# EAGLE design Adafruit SHT31 Breakout (EAGLE 6.6.0)
COMPANY: ADAFRUIT INDUSTRIES; DRAWN: KTOWN; REV: A
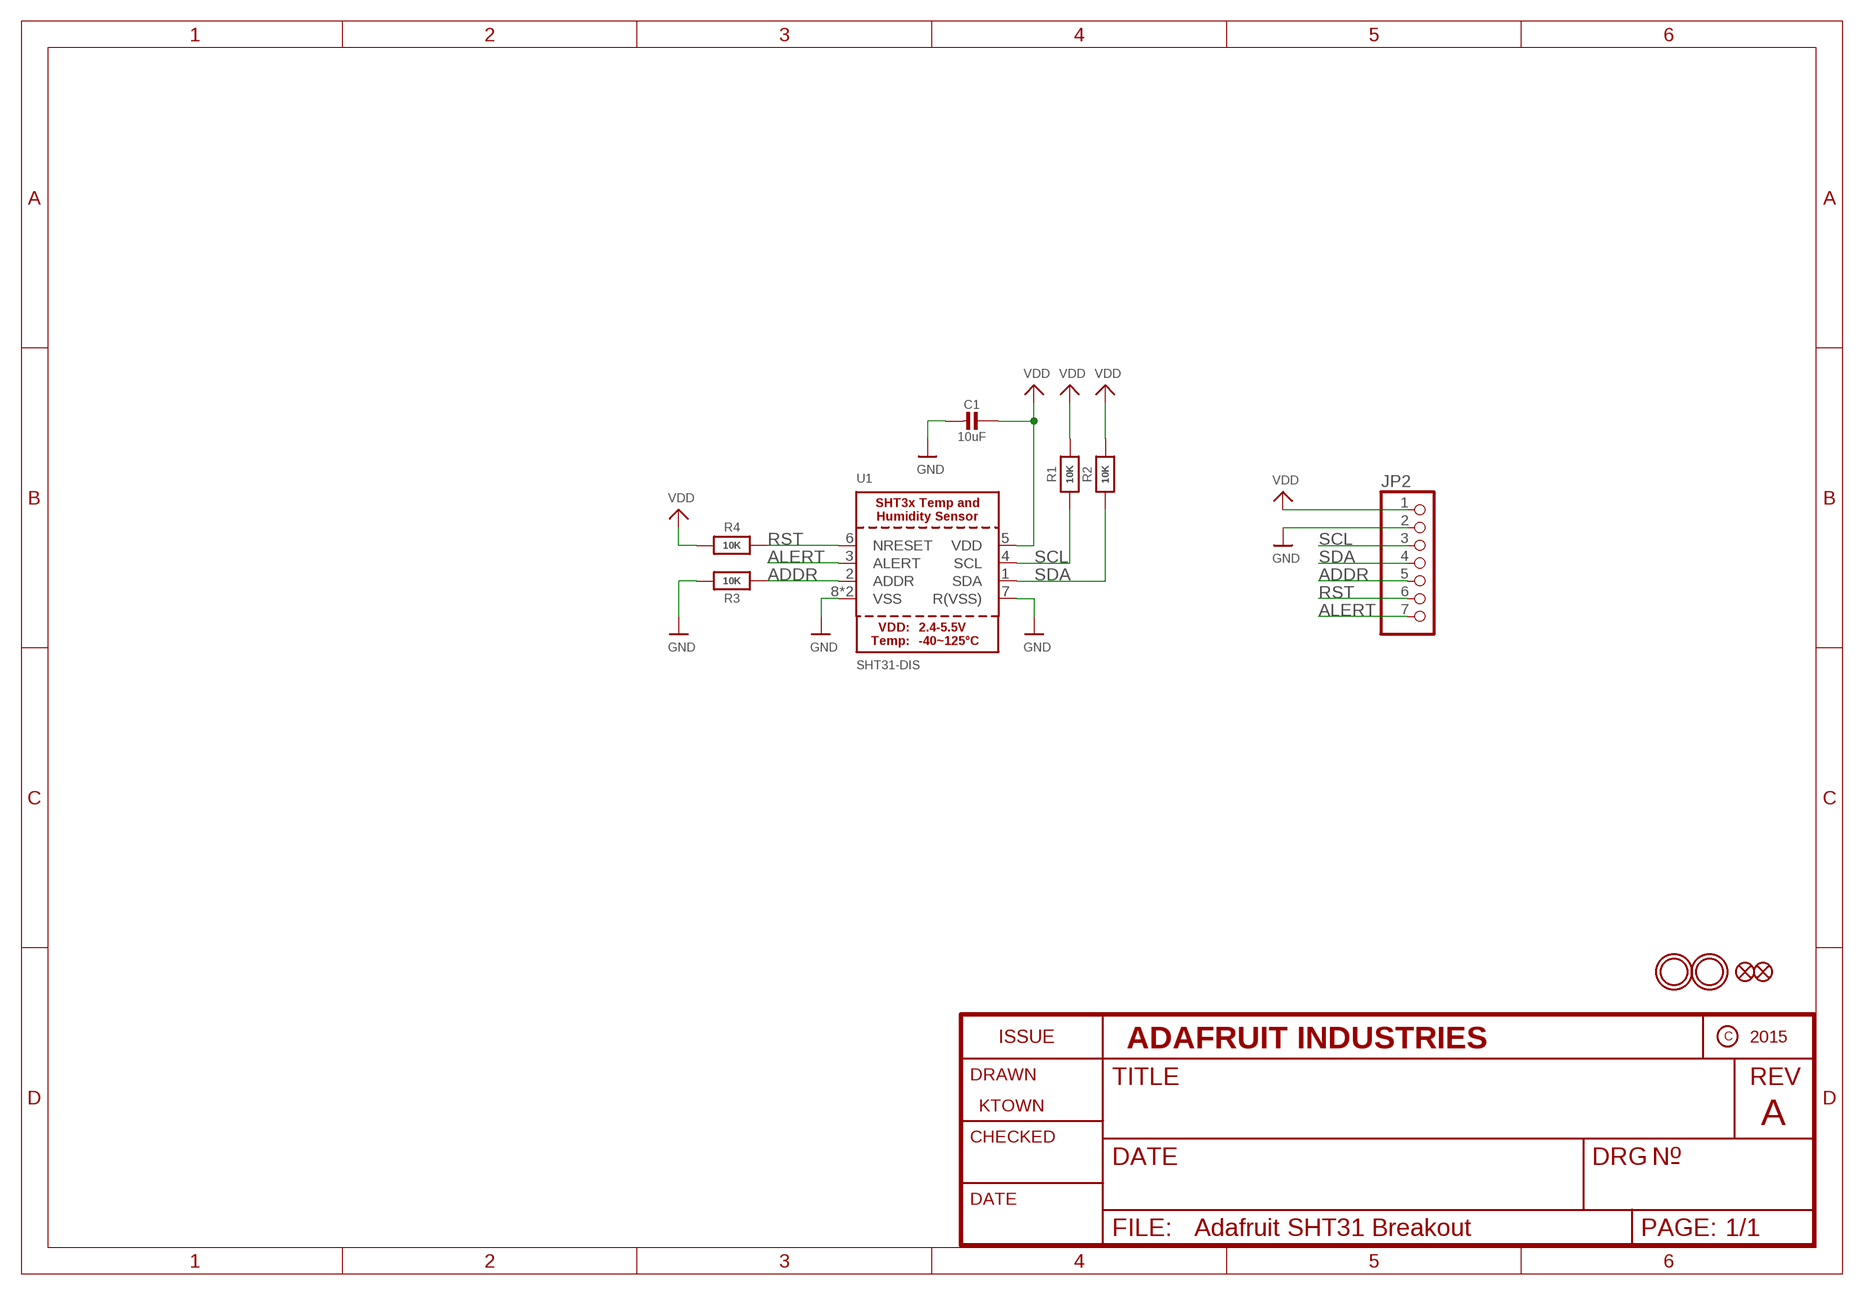
[diagram p0: schematic, sheet 1]

## Parts
C1  10uF  CAP_CERAMIC0805-NOOUTLINE  [0805-NO]
FID2  FIDUCIAL""  [FIDUCIAL_1MM]
FID3  FIDUCIAL""  [FIDUCIAL_1MM]
JP2  HEADER-1X770MIL  [1X07_ROUND_70]
R1  10K  RESISTOR0805_NOOUTLINE  [0805-NO]
R2  10K  RESISTOR0805_NOOUTLINE  [0805-NO]
R3  10K  RESISTOR_0805MP  [_0805MP]
R4  10K  RESISTOR0805_NOOUTLINE  [0805-NO]
U1  SHT31-DIS  SHT3X  [SHT3X]
U$1  MOUNTINGHOLE2.5  [MOUNTINGHOLE_2.5_PLATED]
U$2  MOUNTINGHOLE2.5  [MOUNTINGHOLE_2.5_PLATED]

## Nets
ADDR: JP2.5 R3.1 U1.2(ADDR)
ALERT: JP2.7 U1.3(ALERT)
GND: C1.2 JP2.2 R3.2 U1.7(R(VSS)) U1.8(VSS) U1.THERMAL(VSS)
RST: JP2.6 R4.2 U1.6(NRESET)
SCL: JP2.3 R1.1 U1.4(SCL)
SDA: JP2.4 R2.1 U1.1(SDA)
VDD: C1.1 JP2.1 R1.2 R2.2 R4.1 U1.5(VDD)

## Library data of the parts
C1 = microbuilder:CAP_CERAMIC: Ceramic Capacitors For new designs, use the packages preceded by an '_' character since they are more reliable: The following footprints should be used on most boards: _0402 - Standard footprint for regular board layouts _0603 - Standard footprint for regular board layouts _0805 - Standard footprint for regular board layouts _1206 - Standard footprint for regular board layouts For extremely tight-pitch boards where space is at a premium, the following 'micro-pitch' footprints can be used (smaller pads, no silkscreen outline, etc.): _0402MP - Micro-pitch footprint for very dense/compact boards _0603MP - Micro-pitch footprint for very dense/compact boards _0805MP - Micro-pitch footprint for very dense/compact boards _1206MP - Micro-pitch footprint for very dense/compact boards
FID2 FID3 = microbuilder:FIDUCIAL: Fiducial Alignment Points Various fiducial points for machine vision alignment.; BOM: EXCLUDE
JP2 = microbuilder:HEADER-1X7: PIN HEADER
R1-R4 = microbuilder:RESISTOR: Resistors For new designs, use the packages preceded by an '_' character since they are more reliable: The following footprints should be used on most boards: _0402 - Standard footprint for regular board layouts _0603 - Standard footprint for regular board layouts _0805 - Standard footprint for regular board layouts _1206 - Standard footprint for regular board layouts For extremely tight-pitch boards where space is at a premium, the following 'micro-pitch' footprints can be used (smaller pads, no silkscreen outline, etc.): _0402MP - Micro-pitch footprint for very dense/compact boards _0603MP - Micro-pitch footprint for very dense/compact boards _0805MP - Micro-pitch footprint for very dense/compact boards _1206MP - Micro-pitch footprint for very dense/compact boards
U1 = microbuilder:SHT3X: SHT3x - Digital Temperature and Humidity Sensor Supply Voltage: 2.4-5.5V Humidity Accuracy: SHT30 = +/-3%RH, SHT31 = +/-2%RH Temperature Sensor: -40~125°C (+/-0.3°C from 10-55C)
U$1 U$2 = microbuilder:MOUNTINGHOLE: Mounting Hole For #2 screws (0.086"/2.18mm width, 0.094"/2.4mm hole) use 2.5mm; BOM: EXCLUDE

## Board
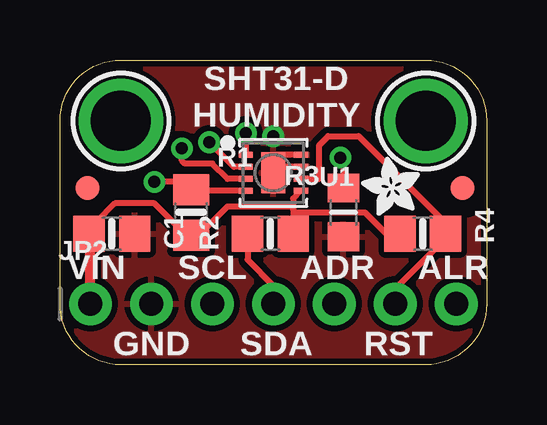
[diagram p1: board, top side]
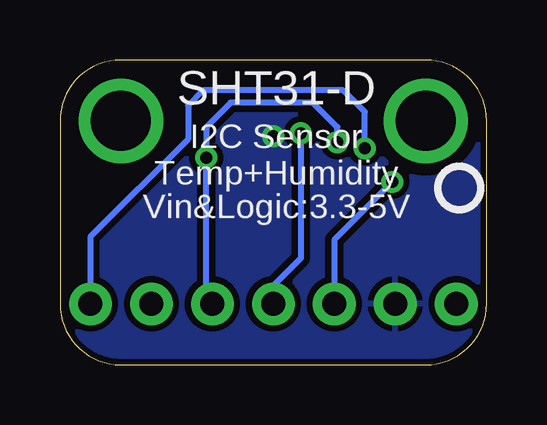
[diagram p2: board, bottom side, seen from below]

Size 17.78 x 12.7 mm. Coordinates in mm from the lower left corner, seen from the top.
Outline: 17.78,10.16 17.78,2.54 arc-90 15.24,0 2.54,0 arc-90 0,2.54 0,10.16 arc-90 2.54,12.7 15.24,12.7 arc-90 17.78,10.16
Copper layers (1*16): Top 0.035mm / dielectric 1.5mm / Bottom 0.035mm
Design rules "adafruit": minimum track width 8mil, minimum drill 15.5mil, track to track 8mil, track to pad 8mil, pad to pad 8mil, via to via 8mil, smd to smd 8mil, copper to edge 10mil, drill to drill 8mil, minimum pad ring 10mil, minimum via ring 8mil, stop-mask expansion 2mil, vias tented up to drill 20mil, thermal gap 10mil
tRestrict: area 9.9,9 to 10.1,9.1; area 9.9,8.5 to 10.1,8.6

### Footprints (pad centres in the part's own frame; a part is rotated, then mirrored left to right if it is on the bottom)
0805-NO = smd 1.3 x 1.5: 1 -0.95,0; 2 0.95,0
FIDUCIAL_1MM = smd 1 x 1: 1 0,0
1X07_ROUND_70 = drill 1 pad 1.778: 1 -7.62,0; 2 -5.08,0; 3 -2.54,0; 4 0,0; 5 2.54,0; 6 5.08,0; 7 7.62,0
_0805MP = smd 1.2 x 1.3: 1 -1.016,0; 2 1.016,0
SHT3X = smd 0.6 x 0.25: 1 -1.15,0.75; 2 -1.15,0.25; 3 -1.15,-0.25; 4 -1.15,-0.75; 5 1.15,-0.75; 6 1.15,-0.25; 7 1.15,0.25; 8 1.15,0.75 | smd 1 x 1.7: THERMAL 0,0
MOUNTINGHOLE_2.5_PLATED = drill 2.5 pad 3.2: P$1 0,0

### Placement (x,y rotation side)
C1  2.16,5.46 0 top
FID2  1.14,7.37 0 top
FID3  16.76,7.37 0 top
JP2  8.89,2.54 0 top
R1  5.46,6.35 270 top
R2  8.76,5.46 0 top
R3  11.81,6.35 270 top
R4  15.11,5.46 0 top
U1  8.89,8 0 top
U$1  2.54,10.16 0 top
U$2  15.24,10.16 0 top
U$11  [PCBFEAT-REV-040]  1.14,7.37 0 bottom
U$13  [ADAFRUIT_2.5MM]  14.99,6.22 90 top

### Tracks (layer width: path | path; a pad name or v marks a point on that pad's centre or on a via)
ADDR  (via drill 0.5)
  Top 0.254: U1.2 7.24,8.25 v6.22,9.27 | v11.68,8.64 11.81,8.51 R3.1
  Bottom 0.254: v6.22,9.27 6.22,9.91 7.24,10.92 10.67,10.92 11.68,9.91 v11.68,8.64 11.68,2.54 JP2.5
ALERT  (via drill 0.5)
  Top 0.254: U1.3 6.98,7.75 6.35,8.38 5.21,8.38 5.08,8.51 v5.08,9.02
  Bottom 0.254: v5.08,9.02 5.08,10.54 5.97,11.43 11.81,11.43 12.45,10.79 12.45,9.4 16.51,5.33 JP2.7
GND  (via drill 0.5)
  Top 0.254: U1.7 9.14,8.25 U1.THERMAL 8.89,8.64 9.01,8.75 U1.8
  other vias: 8.89,9.53
  pour Top (isolate 0.254): 0,0 0,10.16 arc-90 2.54,12.7 15.24,12.7 arc-90 17.78,10.16 17.78,0
  pour Bottom (isolate 0.254): 0,0 0,10.16 arc-90 2.54,12.7 15.24,12.7 arc-90 17.78,10.16 17.78,0
RST
  Top 0.254: U1.6 10.79,7.75 10.79,9.14 11.18,9.53 12.45,9.53 16.06,5.91 R4.2 15.68,4.89 13.97,3.17 JP2.6
SCL  (via drill 0.5)
  Top 0.254: U1.4 5.67,7.25 R1.1 5.14,7.62 v3.94,7.62
  Bottom 0.254: v3.94,7.62 6.35,5.21 JP2.3
SDA  (via drill 0.5)
  Top 0.254: R2.1 7.81,4.38 8.89,3.3 JP2.4 | U1.1 7.76,8.88 v7.75,9.65
  Bottom 0.254: v7.75,9.65 7.75,4.45 8.89,3.3 JP2.4
VDD
  Top 0.254: U1.5 9.71,6.92 9.71,6.48 | 9.71,6.48 R2.2 | 9.65,6.6 6.99,6.6 5.65,5.27 R1.2 5.39,5.27 3.94,6.73 2.29,6.73 1.52,5.97 1.52,5.65 C1.1 | 9.65,6.6 9.71,6.48 | 9.65,6.6 9.78,6.35 12.7,6.35 13.72,5.33 R4.1
  Top 0.406: JP2.1 1.27,5.27 C1.1

### Text on the board
tPlace: SHT31-D / HUMIDITY | VIN | SCL | ADR | ALR | GND | SDA | RST
bPlace: SHT31-D | I2C Sensor / Temp+Humidity | Vin&Logic:3.3-5V